# EAGLE design power_motor_ver2 (EAGLE 9.6.2)
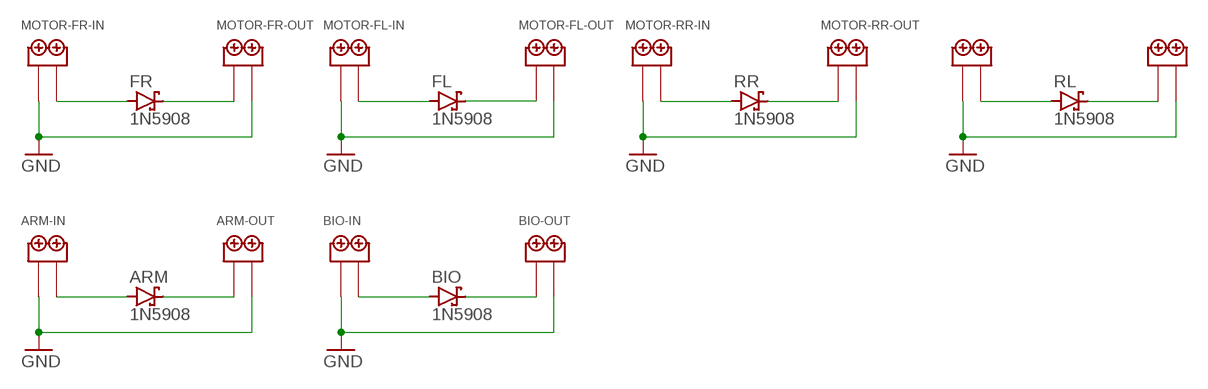
[diagram p0: schematic, sheet 1]

## Parts
ARM  1N5908  [C4111-15]
ARM-IN  2PIN  [2PIN]
ARM-OUT  2PIN  [2PIN]
BIO  1N5908  [C4111-15]
BIO-IN  2PIN  [2PIN]
BIO-OUT  2PIN  [2PIN]
FL  1N5908  [C4111-15]
FR  1N5908  [C4111-15]
MOTOR-FL-IN  2PIN  [2PIN]
MOTOR-FL-OUT  2PIN  [2PIN]
MOTOR-FR-IN  2PIN  [2PIN]
MOTOR-FR-OUT  2PIN  [2PIN]
MOTOR-RL-IN  2PIN  [2PIN]
MOTOR-RL-OUT  2PIN  [2PIN]
MOTOR-RR-IN  2PIN  [2PIN]
MOTOR-RR-OUT  2PIN  [2PIN]
RL  1N5908  [C4111-15]
RR  1N5908  [C4111-15]

## Nets
GND: ARM-IN.P$1 ARM-OUT.P$2 BIO-IN.P$1 BIO-OUT.P$2 MOTOR-FL-IN.P$1 MOTOR-FL-OUT.P$2 MOTOR-FR-IN.P$1 MOTOR-FR-OUT.P$2 MOTOR-RL-IN.P$1 MOTOR-RL-OUT.P$2 MOTOR-RR-IN.P$1 MOTOR-RR-OUT.P$2
N$4 [power]: FR.A MOTOR-FR-IN.P$2
N$5 [power]: FR.C MOTOR-FR-OUT.P$1
N$8 [power]: FL.A MOTOR-FL-IN.P$2
N$10 [power]: FL.C MOTOR-FL-OUT.P$1
N$12 [power]: MOTOR-RR-IN.P$2 RR.A
N$13 [power]: MOTOR-RR-OUT.P$1 RR.C
N$15 [power]: MOTOR-RL-IN.P$2 RL.A
N$16 [power]: MOTOR-RL-OUT.P$1 RL.C
N$19 [power]: ARM-IN.P$2 ARM.A
N$20 [power]: ARM-OUT.P$1 ARM.C
N$22 [power]: BIO-IN.P$2 BIO.A
N$23 [power]: BIO-OUT.P$1 BIO.C

## Library data of the parts
ARM BIO FL FR RL RR = diode:1N5908: DIODE schottky
ARM-IN ARM-OUT BIO-IN BIO-OUT MOTOR-FL-IN MOTOR-FL-OUT MOTOR-FR-IN MOTOR-FR-OUT MOTOR-RL-IN MOTOR-RL-OUT MOTOR-RR-IN MOTOR-RR-OUT = TB113-2B-x-x-0-x-x:2PIN

## Net classes
0 default: width 0.762 mm
1 power: width 7.62 mm, clearance 0.127 mm

## Board
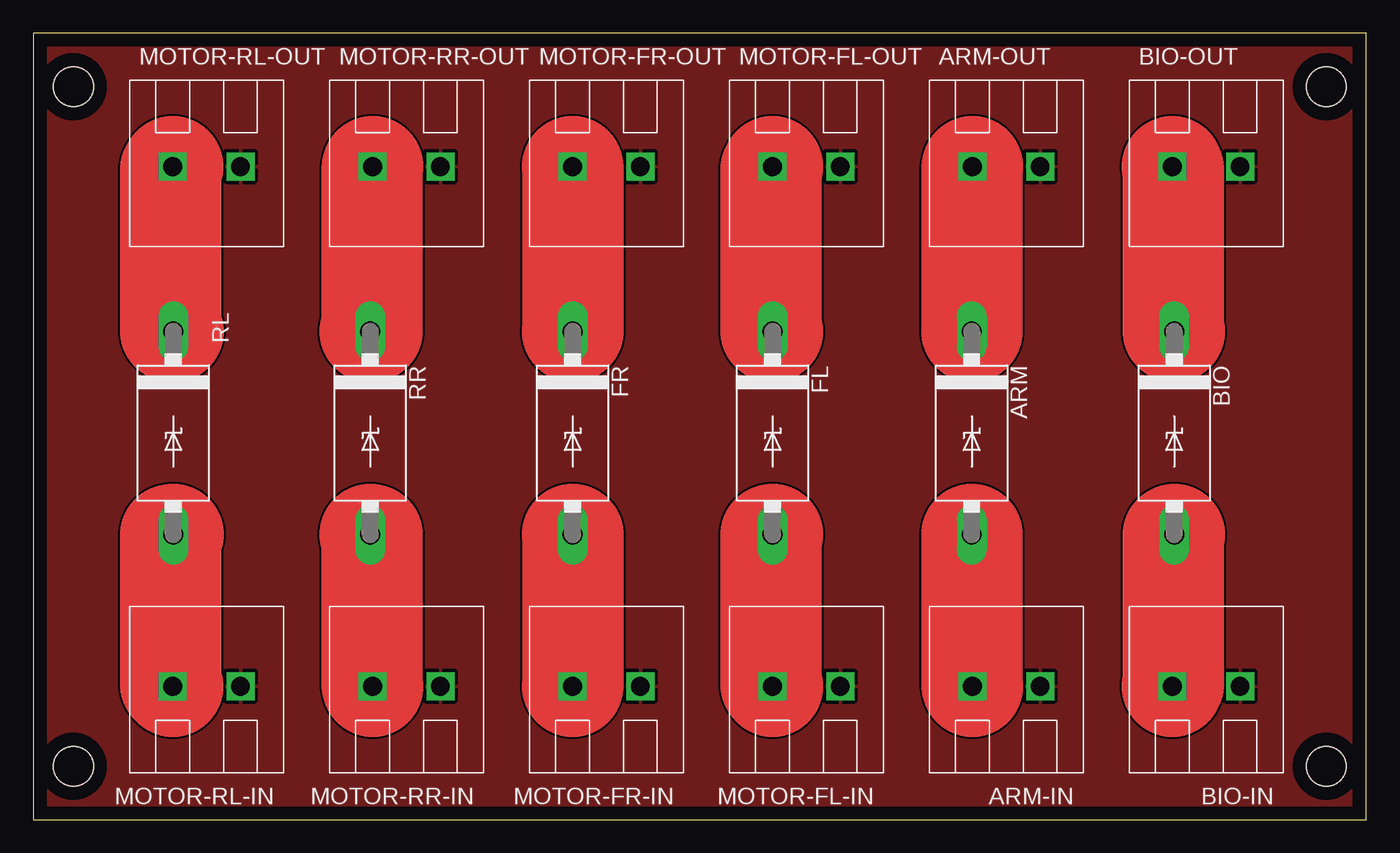
[diagram p1: board, top side]
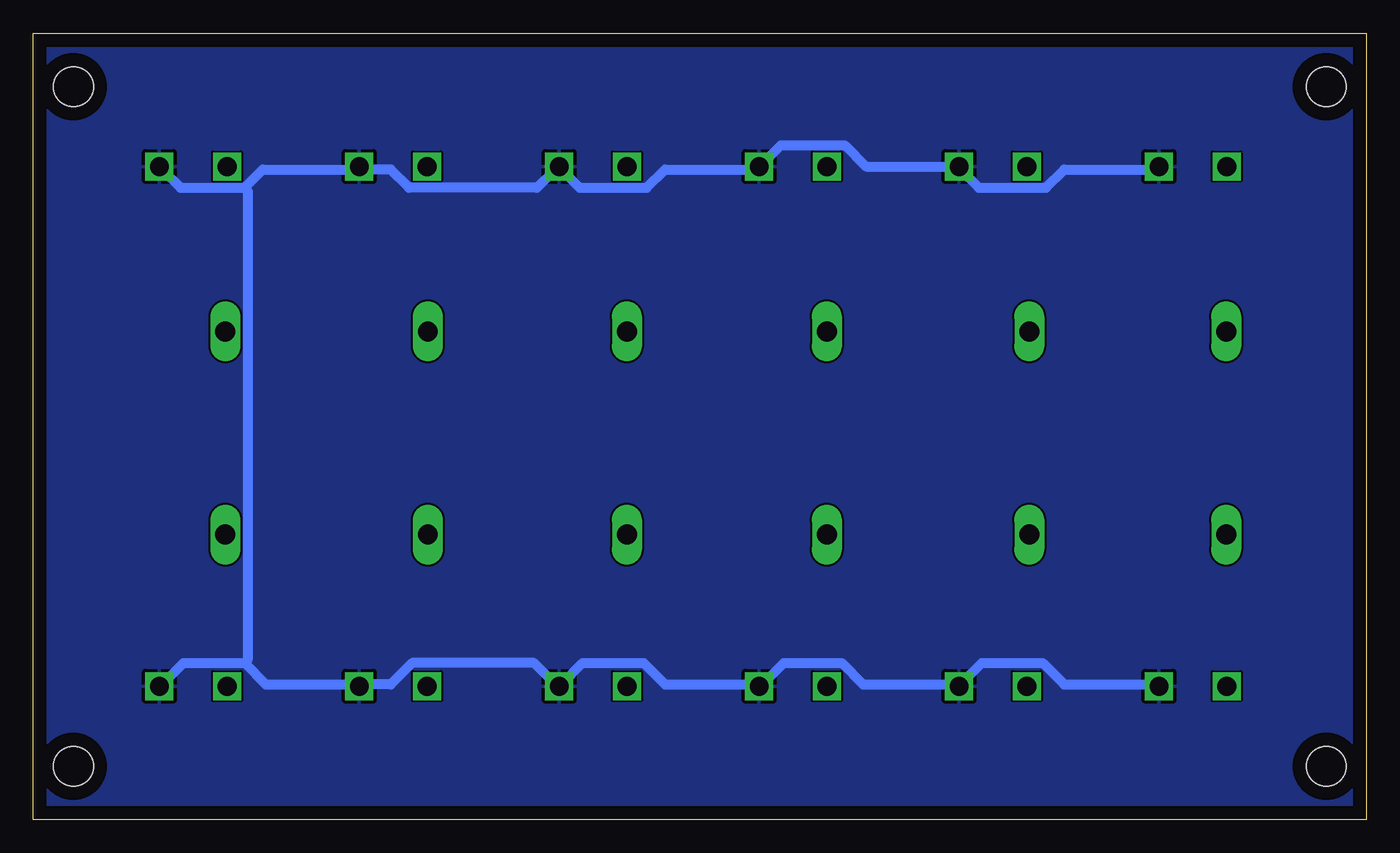
[diagram p2: board, bottom side, seen from below]

Size 100 x 59 mm. Coordinates in mm from the lower left corner, seen from the top.
Outline: 0,0 100,0 100,59 0,59 0,0
Copper layers (1*16): Top 0.035mm / dielectric 1.5mm / Bottom 0.035mm
Design rules "default": minimum track width 6mil, minimum drill 0.35mm, track to track 6mil, track to pad 6mil, pad to pad 6mil, via to via 6mil, smd to smd 6mil, copper to edge 40mil, drill to drill 6mil, minimum pad ring 10mil, minimum via ring 8mil, stop-mask expansion 4mil, vias tented up to drill 0mil, thermal gap 10mil
Holes 3 mm at 3,55 3,4 97,55 97,4

### Footprints (pad centres in the part's own frame; a part is rotated, then mirrored left to right if it is on the bottom)
C4111-15 = drill 1.499 long: A 7.62,0; C -7.62,0
2PIN = drill 1.4 square: P$1 -2.54,0; P$2 2.54,0

### Placement (x,y rotation side)
ARM  70.4,29 270 top
ARM-IN  73,10 180 top
ARM-OUT  73,49 0 top
BIO  85.6,29 270 top
BIO-IN  88,10 180 top
BIO-OUT  88,49 0 top
FL  55.47,29 270 top
FR  40.47,29 270 top
MOTOR-FL-IN  58,10 180 top
MOTOR-FL-OUT  58,49 0 top
MOTOR-FR-IN  43,10 180 top
MOTOR-FR-OUT  43,49 0 top
MOTOR-RL-IN  13,10 180 top
MOTOR-RL-OUT  13,49 0 top
MOTOR-RR-IN  28,10 180 top
MOTOR-RR-OUT  28,49 0 top
RL  10.5,29 270 top
RR  25.28,29 270 top

### Tracks (layer width: path | path; a pad name or v marks a point on that pad's centre or on a via)
GND
  Bottom 0.762: 84.15,11.74 82.55,10.14 75.69,10.14 ARM-IN.P$1 75.24,10.14 73.18,10.14 71.58,11.74 62.44,11.74 60.84,10.14 MOTOR-FL-IN.P$1 60.38,10.14 58.78,11.74 54.21,11.74 52.61,10.14 45.75,10.14 MOTOR-FR-IN.P$1 45.29,10.14 43.69,11.74 39.35,11.74 37.75,10.14 30.89,10.14 MOTOR-RR-IN.P$1 30.43,10.14 28.83,11.74 24.26,11.74 22.66,10.14 15.57,10.14 MOTOR-RL-IN.P$1 | 84.15,11.74 88.72,11.74 90.33,10.14 BIO-IN.P$1 | 84.15,47.41 82.78,48.78 75.69,48.78 ARM-OUT.P$2 75.24,48.78 73.18,48.78 71.81,47.41 62.21,47.41 60.84,48.78 MOTOR-FL-OUT.P$2 60.38,48.78 59.01,47.41 53.98,47.41 52.61,48.78 45.75,48.78 MOTOR-FR-OUT.P$2 45.29,49.23 43.92,50.6 39.12,50.6 37.52,49.01 30.89,49.01 MOTOR-RR-OUT.P$2 30.43,48.78 29.06,47.41 24.03,47.41 22.66,48.78 15.57,48.78 MOTOR-RL-OUT.P$2 | 84.15,47.41 88.95,47.41 90.33,48.78 BIO-OUT.P$2 | 84.15,11.74 83.92,11.97 83.92,47.18 84.15,47.41
  pour Top: -2,62 103,62 103,-2 102,-3 -1,-3 -4,0 -4,60
  pour Bottom: -3,64 103,64 106,61 106,-1 102,-5 -2,-5 -6,-1 -6,61
N$4
  Top 7.62: MOTOR-FR-IN.P$2 40.49,10.14 40.49,21.34 FR.A
N$5
  Top 7.62: MOTOR-FR-OUT.P$1 40.49,48.78 40.49,36.66 FR.C
N$8
  Top 7.62: MOTOR-FL-IN.P$2 55.35,10.14 55.35,21.34 FL.A
N$10
  Top 7.62: MOTOR-FL-OUT.P$1 55.35,48.78 55.35,36.66 FL.C
N$12
  Top 7.62: MOTOR-RR-IN.P$2 25.4,10.14 25.4,21.34 RR.A
N$13
  Top 7.62: MOTOR-RR-OUT.P$1 25.4,48.78 25.4,36.66 RR.C
N$15
  Top 7.62: MOTOR-RL-IN.P$2 10.32,10.14 10.32,21.34 RL.A
N$16
  Top 7.62: MOTOR-RL-OUT.P$1 10.32,48.78 10.32,36.66 RL.C
N$19
  Top 7.62: ARM-IN.P$2 70.44,10.14 70.44,21.34 ARM.A
N$20
  Top 7.62: ARM-OUT.P$1 70.44,48.78 70.44,36.66 ARM.C
N$22
  Top 7.62: BIO-IN.P$2 85.53,10.14 85.53,21.34 BIO.A
N$23
  Top 7.62: BIO-OUT.P$1 85.53,48.78 85.53,36.66 BIO.C